# EAGLE design FYDP-Schematic (EAGLE 8.5.2)

## Sheet 1 of 2
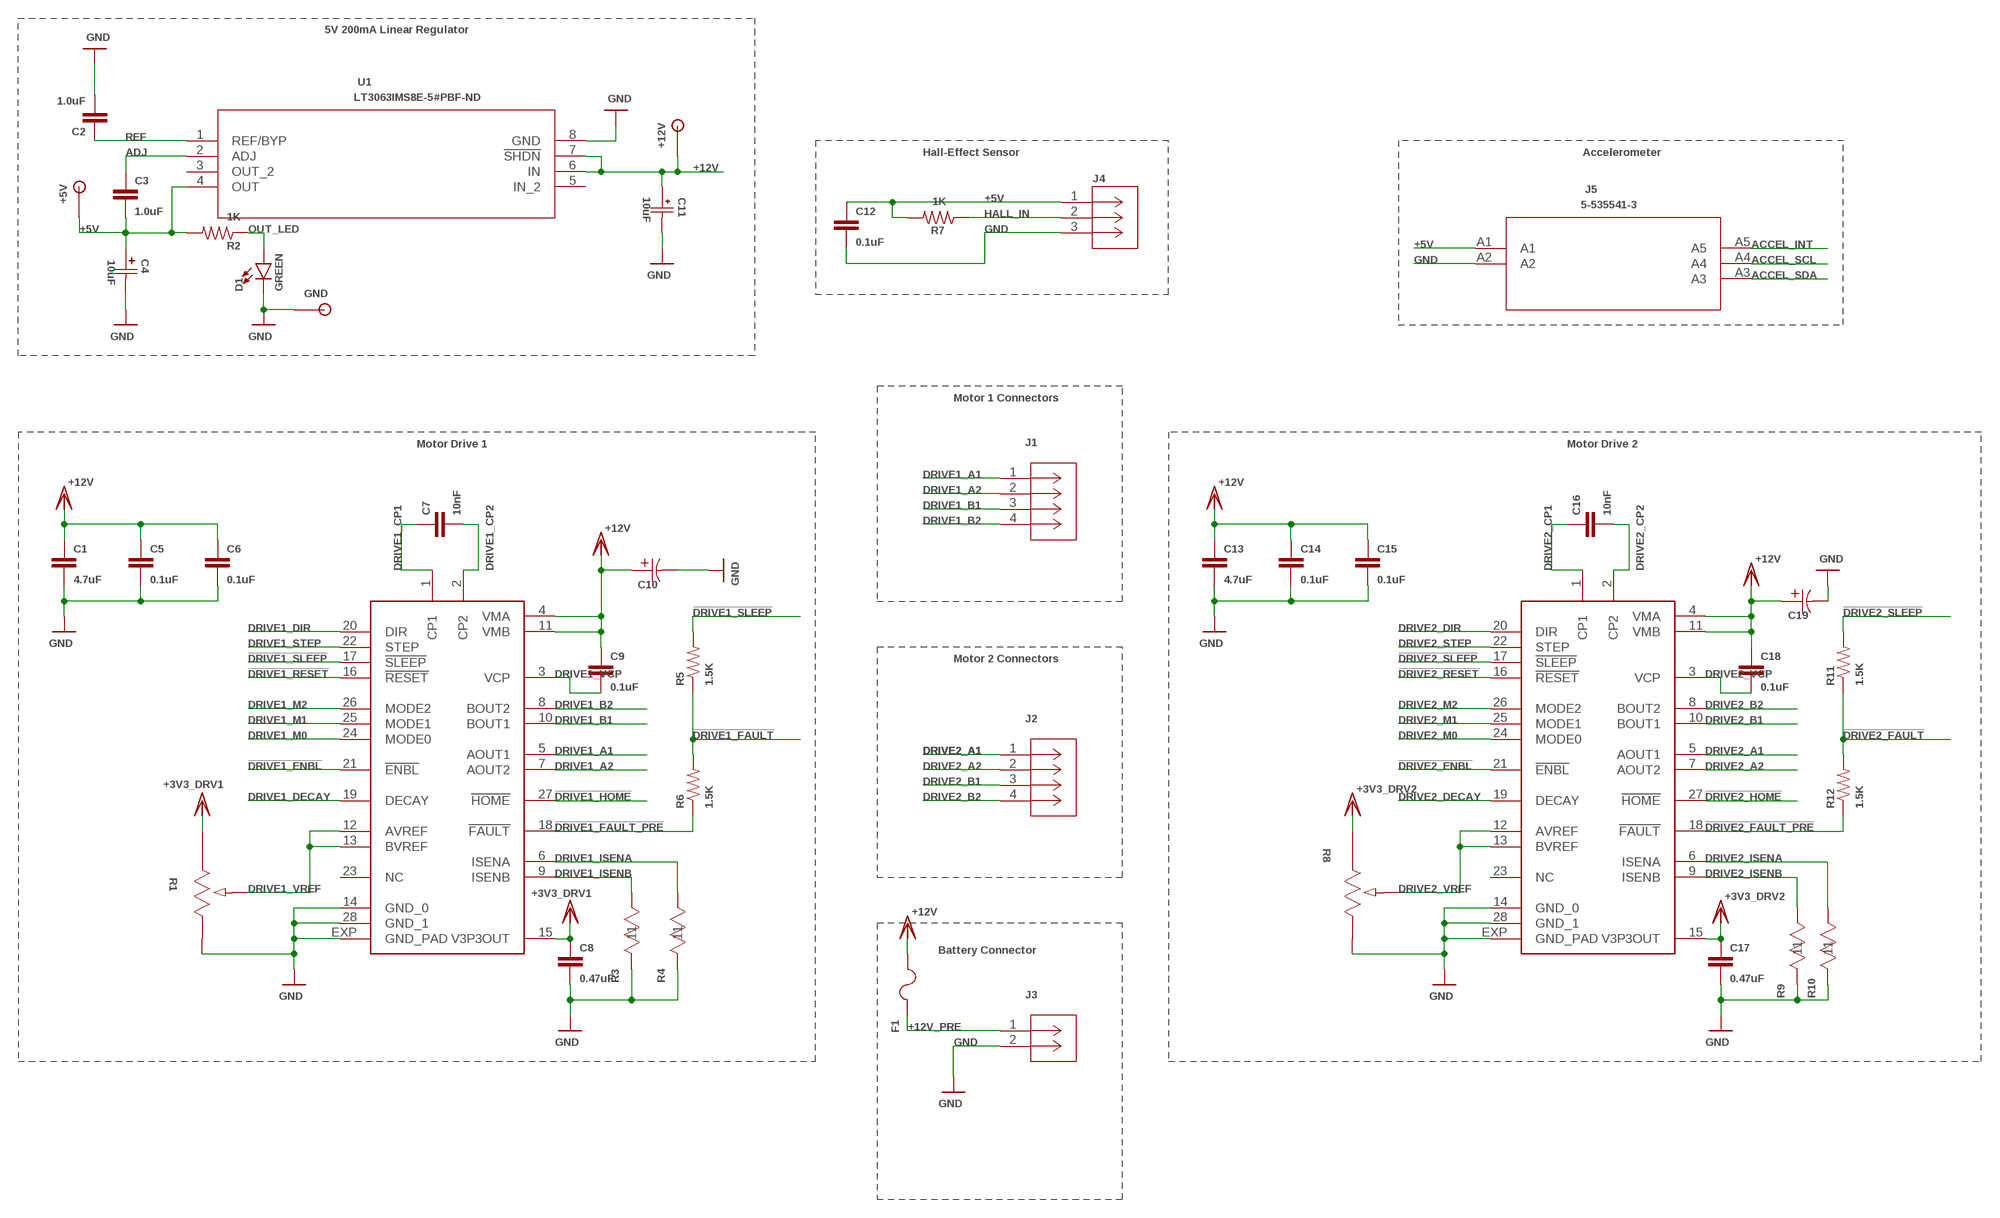
[diagram p0: schematic, sheet 1]

### Parts
+5V  TESTPOINT  [TESTPOINT]
+12V  TESTPOINT  [TESTPOINT]
C1  4.7uF  C_0603  [0603]
C2  1.0uF  1.0UF-0603-16V-10%  [0603]
C3  1.0uF  1.0UF-0603-16V-10%  [0603]
C4  10uF  F931C106MBA  [F93-C]
C5  0.1uF  C_0603  [0603]
C6  0.1uF  C_0603  [0603]
C7  10nF  C_0603  [0603]
C8  0.47uF  C_0603  [0603]
C9  0.1uF  C_0603  [0603]
C10  UWX1C101MCL1GB  [PCAP_6.3X5.4-ELECT]
C11  10uF  GRM188C81C106MA73D  [G-188]
C12  0.1uF  C_0603  [0603]
C13  4.7uF  C_0603  [0603]
C14  0.1uF  C_0603  [0603]
C15  0.1uF  C_0603  [0603]
C16  10nF  C_0603  [0603]
C17  0.47uF  C_0603  [0603]
C18  0.1uF  C_0603  [0603]
C19  UWX1C101MCL1GB  [PCAP_6.3X5.4-ELECT]
D1  GREEN  LED-GREEN0603  [LED-0603]
F1  1210L110/12WR  [1210LSERIES]
GND  TESTPOINT  [TESTPOINT]
J1  2029030-4  [CONN_2029030-4]
J2  2029030-4  [CONN_2029030-4]
J3  2029030-2  [CONN_2029030-2]
J4  2029030-3  [CONN_2029030-3]
J5  5-535541-3  [5-535541-3]
R1  3314G-1-103E  [POT_3314G]
R2  1K  R_0603  [0603]
R3  CSR1206FKR200  [STA_CSR1206]
R4  CSR1206FKR200  [STA_CSR1206]
R5  1.5K  R_0603  [0603]
R6  1.5K  R_0603  [0603]
R7  1K  R_0603  [0603]
R8  3314G-1-103E  [POT_3314G]
R9  CSR1206FKR200  [STA_CSR1206]
R10  CSR1206FKR200  [STA_CSR1206]
R11  1.5K  R_0603  [0603]
R12  1.5K  R_0603  [0603]
U1  LT3063IMS8E-5#PBF-ND  LT3063IMS8EPBF  [MSOP-8_MS]
U2  DRV8825PWP  [TSSOP-28]
U3  DRV8825PWP  [TSSOP-28]

### Nets
!DRIVE1_ENBL!: U3.21(!ENBL!) ; also sheet 2
!DRIVE1_FAULT!: R5.1 R6.2 ; also sheet 2
!DRIVE1_FAULT_PRE!: R6.1 U3.18(!FAULT!)
!DRIVE1_HOME!: U3.27(!HOME!) ; also sheet 2
!DRIVE1_RESET!: U3.16(!RESET!) ; also sheet 2
!DRIVE1_SLEEP!: R5.2 U3.17(!SLEEP!) ; also sheet 2
!DRIVE2_ENBL!: U2.21(!ENBL!) ; also sheet 2
!DRIVE2_FAULT!: R11.1 R12.2 ; also sheet 2
!DRIVE2_FAULT_PRE!: R12.1 U2.18(!FAULT!)
!DRIVE2_HOME!: U2.27(!HOME!) ; also sheet 2
!DRIVE2_RESET!: U2.16(!RESET!) ; also sheet 2
!DRIVE2_SLEEP!: R11.2 U2.17(!SLEEP!) ; also sheet 2
+3V3_DRV1: C8.1 R1.1 U3.15(V3P3OUT)
+3V3_DRV2: C17.1 R8.1 U2.15(V3P3OUT)
+5V: +5V.TP C3.2 C4.POS C12.1 J4.1 J5.A1 R2.2 R7.2 U1.4(OUT) ; also sheet 2
+12V [+12V]: +12V.TP C1.1 C5.1 C6.1 C9.1 C10.1 C11.PWR C13.1 C14.1 C15.1 C18.1 C19.1 F1.2 U1.6(IN) U1.7(!SHDN) U2.4(VMA) U2.11(VMB) U3.4(VMA) U3.11(VMB)
+12V_PRE [+12V]: F1.1 J3.1
ACCEL_INT: J5.A5 ; also sheet 2
ACCEL_SCL: J5.A4 ; also sheet 2
ACCEL_SDA: J5.A3 ; also sheet 2
ADJ: C3.1 U1.2(ADJ)
DRIVE1_A1: J1.1 U3.5(AOUT1)
DRIVE1_A2: J1.2 U3.7(AOUT2)
DRIVE1_B1: J1.3 U3.10(BOUT1)
DRIVE1_B2: J1.4 U3.8(BOUT2)
DRIVE1_CP1: C7.1 U3.1(CP1)
DRIVE1_CP2: C7.2 U3.2(CP2)
DRIVE1_DECAY: U3.19(DECAY) ; also sheet 2
DRIVE1_DIR: U3.20(DIR) ; also sheet 2
DRIVE1_ISENA: R4.2 U3.6(ISENA)
DRIVE1_ISENB: R3.2 U3.9(ISENB)
DRIVE1_M0: U3.24(MODE0) ; also sheet 2
DRIVE1_M1: U3.25(MODE1) ; also sheet 2
DRIVE1_M2: U3.26(MODE2) ; also sheet 2
DRIVE1_STEP: U3.22(STEP) ; also sheet 2
DRIVE1_VCP: C9.2 U3.3(VCP)
DRIVE1_VREF: R1.2 U3.12(AVREF) U3.13(BVREF)
DRIVE2_A1 [DRIVE2]: J2.1 U2.5(AOUT1)
DRIVE2_A2 [DRIVE2]: J2.2 U2.7(AOUT2)
DRIVE2_B1 [DRIVE2]: J2.3 U2.10(BOUT1)
DRIVE2_B2 [DRIVE2]: J2.4 U2.8(BOUT2)
DRIVE2_CP1: C16.1 U2.1(CP1)
DRIVE2_CP2: C16.2 U2.2(CP2)
DRIVE2_DECAY: U2.19(DECAY) ; also sheet 2
DRIVE2_DIR: U2.20(DIR) ; also sheet 2
DRIVE2_ISENA: R10.2 U2.6(ISENA)
DRIVE2_ISENB: R9.2 U2.9(ISENB)
DRIVE2_M0: U2.24(MODE0) ; also sheet 2
DRIVE2_M1: U2.25(MODE1) ; also sheet 2
DRIVE2_M2: U2.26(MODE2) ; also sheet 2
DRIVE2_STEP: U2.22(STEP) ; also sheet 2
DRIVE2_VCP: C18.2 U2.3(VCP)
DRIVE2_VREF: R8.2 U2.12(AVREF) U2.13(BVREF)
GND: C1.2 C2.2 C4.GND C5.2 C6.2 C8.2 C10.2 C11.GND C12.2 C13.2 C14.2 C15.2 C17.2 C19.2 D1.C GND.TP J3.2 J4.3 J5.A2 R1.3 R3.1 R4.1 R8.3 R9.1 R10.1 U1.8(GND) U2.14(GND_0) U2.28(GND_1) U2.EXP(GND_PAD) U3.14(GND_0) U3.28(GND_1) U3.EXP(GND_PAD) ; also sheet 2
HALL_IN: J4.2 R7.1 ; also sheet 2
OUT_LED: D1.A R2.1
REF: C2.1 U1.1(REF/BYP)
Unconnected: U1.3(OUT_2) U1.5(IN_2) U2.23(NC) U3.23(NC)

### Notes on the sheet
- 5V 200mA Linear Regulator
- Hall-Effect Sensor | Accelerometer
- Motor 1 Connectors
- Motor Drive 1 | Motor Drive 2
- Motor 2 Connectors
- Battery Connector

## Sheet 2 of 2
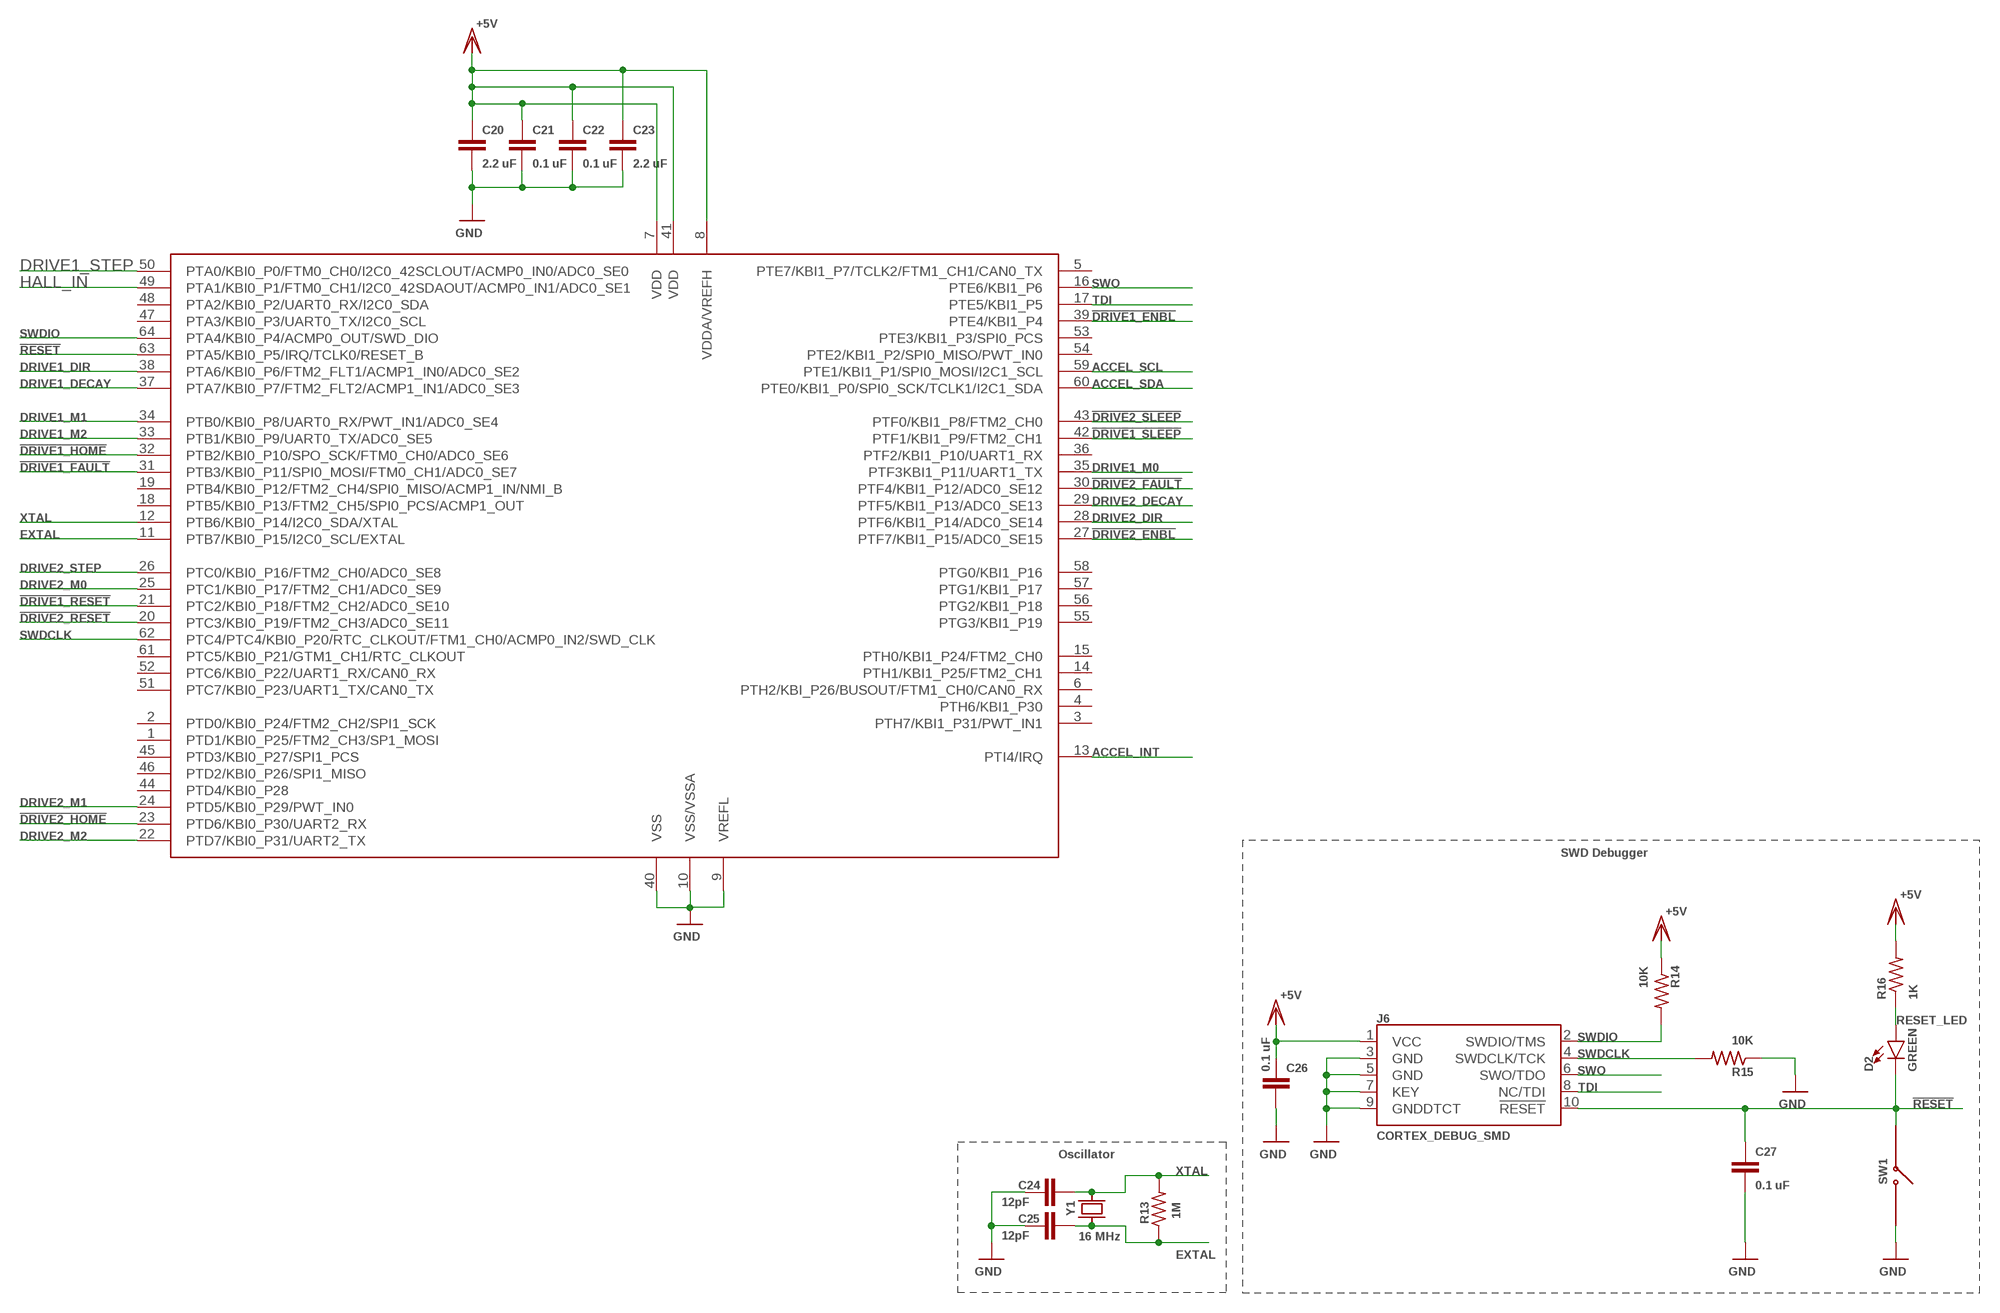
[diagram p1: schematic, sheet 2]

### Parts
C20  2.2 uF  C_0603  [0603]
C21  0.1 uF  C_0603  [0603]
C22  0.1 uF  C_0603  [0603]
C23  2.2 uF  C_0603  [0603]
C24  12pF  C_0603  [0603]
C25  12pF  C_0603  [0603]
C26  0.1 uF  C_0603  [0603]
C27  0.1 uF  C_0603  [0603]
D2  GREEN  LED-GREEN0603  [LED-0603]
J6  CORTEX_DEBUG_SMD  [SAMTECH_FTSH-105-01]
R13  1M  R_0603  [0603]
R14  10K  R_0603  [0603]
R15  10K  R_0603  [0603]
R16  1K  R_0603  [0603]
SW1  KSR223GNCLFG  [KSR223GNCLFG]
U4  S9KEA128  [S9KEA128]
Y1  16 MHz  AT-16.000MAGE-T  [AT-16.000MAGE-T]

### Nets
!DRIVE1_ENBL!: U4.39(PTE4/KBI1_P4) ; also sheet 1
!DRIVE1_FAULT!: U4.31(PTB3/KBI0_P11/SPI0_MOSI/FTM0_CH1/ADC0_SE7) ; also sheet 1
!DRIVE1_HOME!: U4.32(PTB2/KBI0_P10/SPO_SCK/FTM0_CH0/ADC0_SE6) ; also sheet 1
!DRIVE1_RESET!: U4.21(PTC2/KBI0_P18/FTM2_CH2/ADC0_SE10) ; also sheet 1
!DRIVE1_SLEEP!: U4.42(PTF1/KBI1_P9/FTM2_CH1) ; also sheet 1
!DRIVE2_ENBL!: U4.27(PTF7/KBI1_P15/ADC0_SE15) ; also sheet 1
!DRIVE2_FAULT!: U4.30(PTF4/KBI1_P12/ADC0_SE12) ; also sheet 1
!DRIVE2_HOME!: U4.23(PTD6/KBI0_P30/UART2_RX) ; also sheet 1
!DRIVE2_RESET!: U4.20(PTC3/KBI0_P19/FTM2_CH3/ADC0_SE11) ; also sheet 1
!DRIVE2_SLEEP!: U4.43(PTF0/KBI1_P8/FTM2_CH0) ; also sheet 1
!RESET!: C27.1 D2.C J6.10(!RESET) SW1.1 U4.63(PTA5/KBI0_P5/IRQ/TCLK0/RESET_B)
+5V: C20.1 C21.1 C22.1 C23.1 C26.1 J6.1(VCC) R14.1 R16.2 U4.7(VDD) U4.8(VDDA/VREFH) U4.41(VDD) ; also sheet 1
ACCEL_INT: U4.13(PTI4/IRQ) ; also sheet 1
ACCEL_SCL: U4.59(PTE1/KBI1_P1/SPI0_MOSI/I2C1_SCL) ; also sheet 1
ACCEL_SDA: U4.60(PTE0/KBI1_P0/SPI0_SCK/TCLK1/I2C1_SDA) ; also sheet 1
DRIVE1_DECAY: U4.37(PTA7/KBI0_P7/FTM2_FLT2/ACMP1_IN1/ADC0_SE3) ; also sheet 1
DRIVE1_DIR: U4.38(PTA6/KBI0_P6/FTM2_FLT1/ACMP1_IN0/ADC0_SE2) ; also sheet 1
DRIVE1_M0: U4.35(PTF3KBI1_P11/UART1_TX) ; also sheet 1
DRIVE1_M1: U4.34(PTB0/KBI0_P8/UART0_RX/PWT_IN1/ADC0_SE4) ; also sheet 1
DRIVE1_M2: U4.33(PTB1/KBI0_P9/UART0_TX/ADC0_SE5) ; also sheet 1
DRIVE1_STEP: U4.50(PTA0/KBI0_P0/FTM0_CH0/I2C0_42SCLOUT/ACMP0_IN0/ADC0_SE0) ; also sheet 1
DRIVE2_DECAY: U4.29(PTF5/KBI1_P13/ADC0_SE13) ; also sheet 1
DRIVE2_DIR: U4.28(PTF6/KBI1_P14/ADC0_SE14) ; also sheet 1
DRIVE2_M0: U4.25(PTC1/KBI0_P17/FTM2_CH1/ADC0_SE9) ; also sheet 1
DRIVE2_M1: U4.24(PTD5/KBI0_P29/PWT_IN0) ; also sheet 1
DRIVE2_M2: U4.22(PTD7/KBI0_P31/UART2_TX) ; also sheet 1
DRIVE2_STEP: U4.26(PTC0/KBI0_P16/FTM2_CH0/ADC0_SE8) ; also sheet 1
EXTAL: C25.1 R13.1 U4.11(PTB7/KBI0_P15/I2C0_SCL/EXTAL) Y1.1
GND: C20.2 C21.2 C22.2 C23.2 C24.2 C25.2 C26.2 C27.2 J6.3(GND) J6.5(GND) J6.7(KEY) J6.9(GNDDTCT) R15.1 SW1.2 U4.9(VREFL) U4.10(VSS/VSSA) U4.40(VSS) ; also sheet 1
HALL_IN: U4.49(PTA1/KBI0_P1/FTM0_CH1/I2C0_42SDAOUT/ACMP0_IN1/ADC0_SE1) ; also sheet 1
RESET_LED: D2.A R16.1
SWDCLK: J6.4(SWDCLK/TCK) R15.2 U4.62(PTC4/PTC4/KBI0_P20/RTC_CLKOUT/FTM1_CH0/ACMP0_IN2/SWD_CLK)
SWDIO: J6.2(SWDIO/TMS) R14.2 U4.64(PTA4/KBI0_P4/ACMP0_OUT/SWD_DIO)
SWO: J6.6(SWO/TDO) U4.16(PTE6/KBI1_P6)
TDI: J6.8(NC/TDI) U4.17(PTE5/KBI1_P5)
XTAL: C24.1 R13.2 U4.12(PTB6/KBI0_P14/I2C0_SDA/XTAL) Y1.2
Unconnected: U4.1(PTD1/KBI0_P25/FTM2_CH3/SP1_MOSI) U4.2(PTD0/KBI0_P24/FTM2_CH2/SPI1_SCK) U4.3(PTH7/KBI1_P31/PWT_IN1) U4.4(PTH6/KBI1_P30) U4.5(PTE7/KBI1_P7/TCLK2/FTM1_CH1/CAN0_TX) U4.6(PTH2/KBI_P26/BUSOUT/FTM1_CH0/CAN0_RX) U4.14(PTH1/KBI1_P25/FTM2_CH1) U4.15(PTH0/KBI1_P24/FTM2_CH0) U4.18(PTB5/KBI0_P13/FTM2_CH5/SPI0_PCS/ACMP1_OUT) U4.19(PTB4/KBI0_P12/FTM2_CH4/SPI0_MISO/ACMP1_IN/NMI_B) U4.36(PTF2/KBI1_P10/UART1_RX) U4.44(PTD4/KBI0_P28) U4.45(PTD3/KBI0_P27/SPI1_PCS) U4.46(PTD2/KBI0_P26/SPI1_MISO) U4.47(PTA3/KBI0_P3/UART0_TX/I2C0_SCL) U4.48(PTA2/KBI0_P2/UART0_RX/I2C0_SDA) U4.51(PTC7/KBI0_P23/UART1_TX/CAN0_TX) U4.52(PTC6/KBI0_P22/UART1_RX/CAN0_RX) U4.53(PTE3/KBI1_P3/SPI0_PCS) U4.54(PTE2/KBI1_P2/SPI0_MISO/PWT_IN0) U4.55(PTG3/KBI1_P19) U4.56(PTG2/KBI1_P18) U4.57(PTG1/KBI1_P17) U4.58(PTG0/KBI1_P16) U4.61(PTC5/KBI0_P21/GTM1_CH1/RTC_CLKOUT)

### Notes on the sheet
- SWD Debugger
- Oscillator

## Library data of the parts
+5V +12V GND = FYDP:TESTPOINT
C1 C5-C9 C12-C18 C20-C27 = RHD2000_eval_board:C: Capacitor
C2 C3 = SparkFun-Capacitors:1.0UF: 1µF ceramic capacitors A capacitor is a passive two-terminal electrical component used to store electrical energy temporarily in an electric field.; PROD_ID: CAP-00868
C4 = capacitors:F931C106MBA; MANUFACTURER_PART_NUMBER: F931C106MBA; VENDOR: AVX Corporation
C10 C19 = FYDP:UWX1C101MCL1GB; MANUFACTURER_PART_NUMBER: UWX1C101MCL1GB; VENDOR: Nichicon
C11 = ceramic-capacitors:GRM188C81C106MA73D; MANUFACTURER_PART_NUMBER: GRM188C81C106MA73D; VENDOR: Murata
D1 D2 = SparkFun-LED:LED-GREEN: Green SMD LED Used in manufacturing of various products at SparkFun Packages: 0603 - SMD 0603 package [Product Link] <http://www.futureelectronics.com/en/technologies/semiconductors/optoelectronics/leds/Pages/9894312-LTST-C190GKT.aspx?CrossPart=HSMG-C190&IM=0> LilyPad 1206 - SMD1206 LilyPad package [Product Link] <http://www.futureelectronics.com/en/Technologies/Product.aspx?ProductID=IN150NGHARVATEKCORPORATION2049943&IM=0> 1206 - SMD1206 package [Product Link] <http://www.futureelectronics.com/en/technologies/semiconductors/optoelectronics/leds/Pages/8315665-LTST-C150KGKT.aspx?IM=0> 1206 Bottom Mount -SMD 1206 Bottom Mount [Product Link] <http://www.digikey.com/product-detail/en/lite-on-inc/LTST-C230KGKT/160-1456-1-ND/386854> SparkFun Products: Pro Mini 328 -5V <https://www.sparkfun.com/products/821> RedBoard <https://www.sparkfun.com/products/12757> MP3 Trigger <https://www.sparkfun.com/products/13720> Makey Makey <https://www.sparkfun.com/products/11076>; PROD_ID: DIO-00821
F1 = FYDP:1210L110/12WR; MANUFACTURER_PART_NUMBER: 1210L11012WR; VENDOR: Littelfuse Inc
J1 J2 = FYDP:2029030-4; MANUFACTURER_PART_NUMBER: 20290304; VENDOR: Tyco Electronics
J3 = FYDP:2029030-2; MANUFACTURER_PART_NUMBER: 20290302; VENDOR: Tyco Electronics
J4 = FYDP:2029030-3; MANUFACTURER_PART_NUMBER: 20290303; VENDOR: TE Connectivity
J5 = FYDP:5-535541-3; MANUFACTURER_PART_NUMBER: 55355413; VENDOR: TE Connectivity
J6 = SparkFun-Connectors:CORTEX_DEBUG: Cortex Debug Connector - 10 pin Supports JTAG debug, Serial Wire debug, and Serial Wire Viewer. PTH and SMD connector options available. General Connector Information <http://infocenter.arm.com/help/topic/com.arm.doc.faqs/attached/13634/cortex_debug_connectors.pdf> Products: PTH Connector <http://www.digikey.com/product-detail/en/cnc-tech/3220-10-0100-00/1175-1627-ND/3883661> -via Digi-Key SparkFun PSoc <https://www.sparkfun.com/products/13229> SparkFun T <https://www.sparkfun.com/products/13810>
R1 R8 = FYDP:3314G-1-103E; MANUFACTURER_PART_NUMBER: 3314G1103E; VENDOR: Bourns Electronics
R2 R5-R7 R11-R16 = RHD2000_eval_board:R: Resistor
R3 R4 R9 R10 = FYDP:CSR1206FKR200; MANUFACTURER_PART_NUMBER: CSR1206FKR200; VENDOR: Stackpole International
SW1 = FYDP:KSR223GNCLFG
U1 = FYDP:LT3063IMS8EPBF; MANUFACTURER_PART_NUMBER: lt3063ims8e#pbf; VENDOR: Linear Technology
U2 U3 = drv8825:DRV8825PWP
U4 = FYDP:S9KEA128
Y1 = FYDP:AT-16.000MAGE-T

## Net classes
0 default: width 0.152 mm, clearance 0.152 mm
1 +12V: width 0.254 mm, clearance 0.254 mm
2 +5V: width 0.381 mm, clearance 0.254 mm
3 DRIVE2: width 0.508 mm, clearance 0.254 mm

## Board
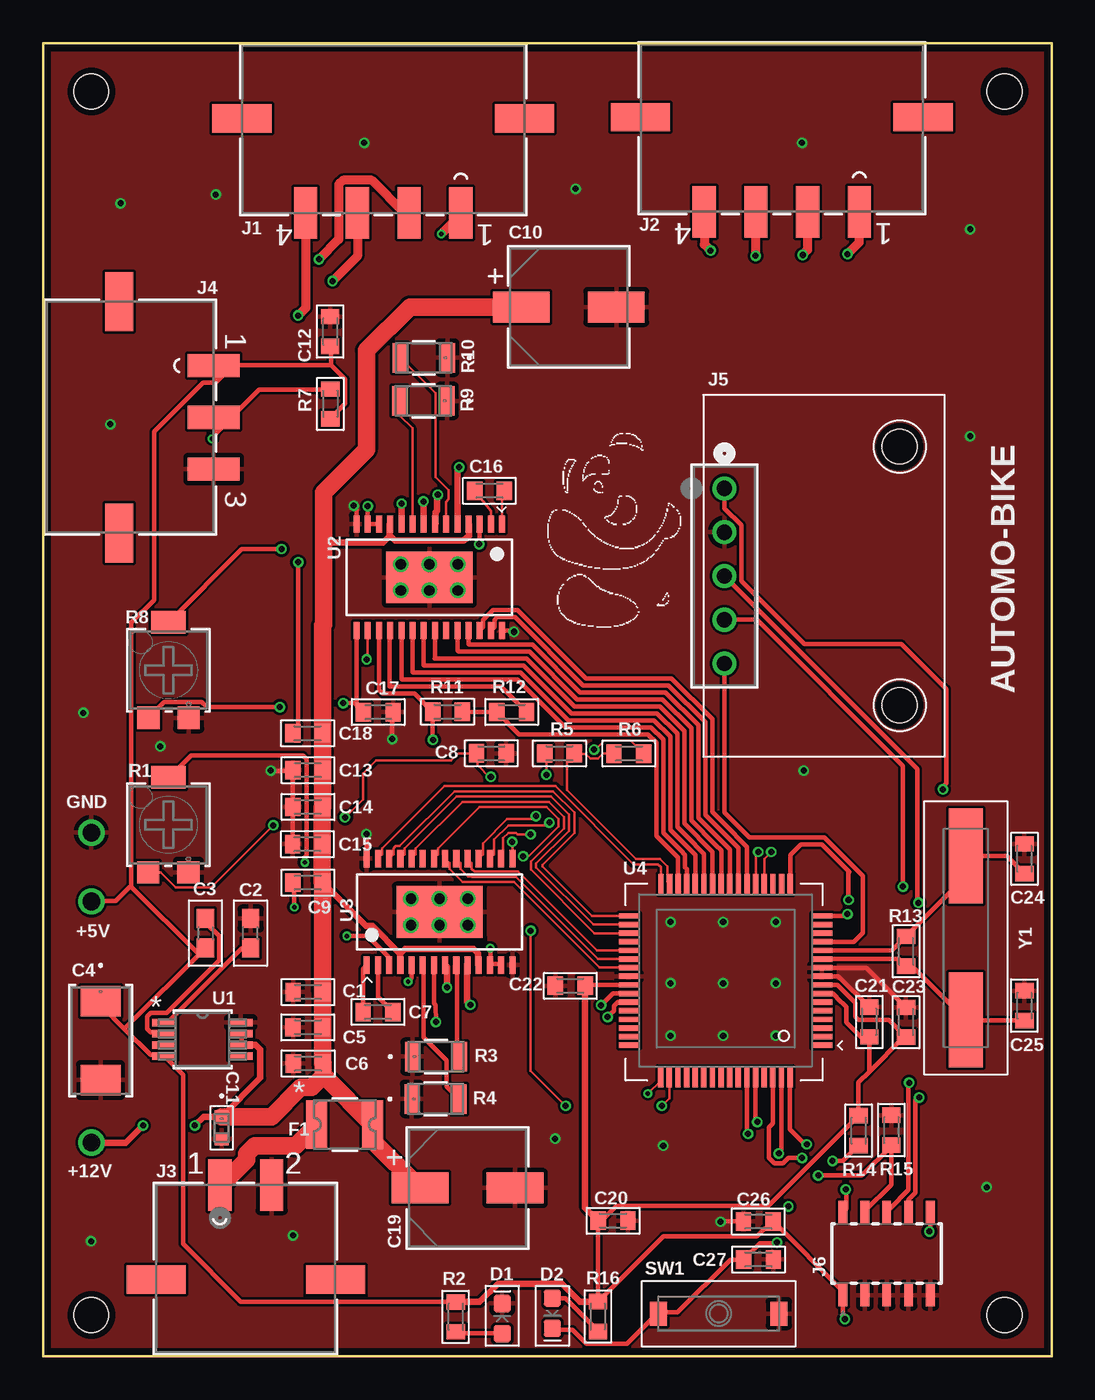
[diagram p2: board, top side]
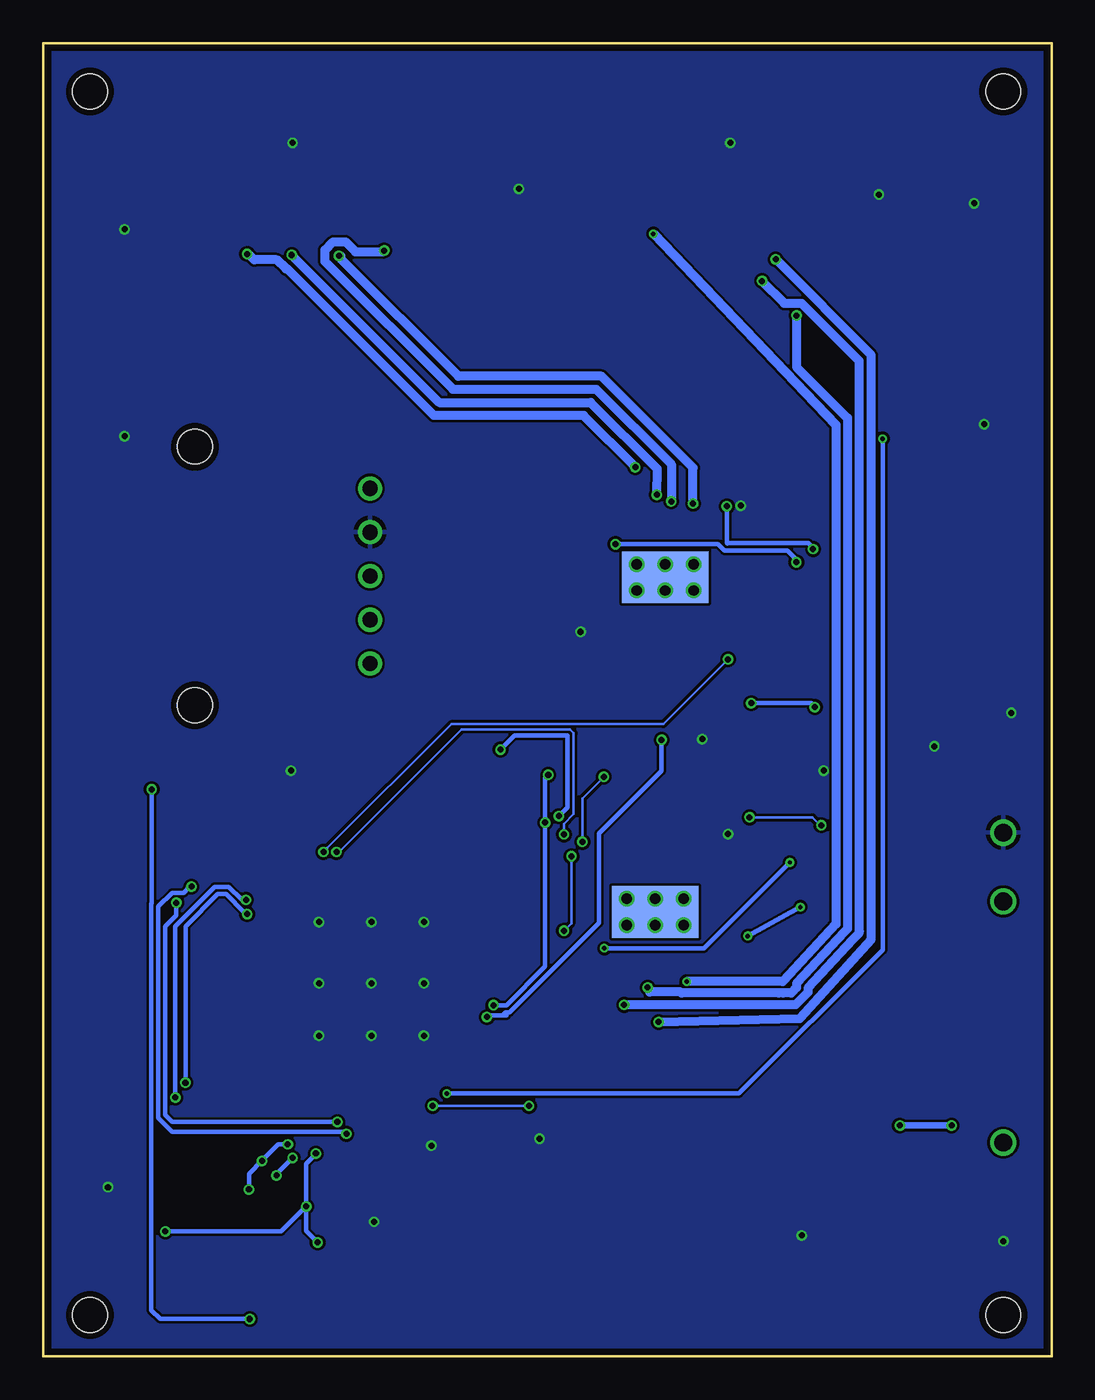
[diagram p3: board, bottom side, seen from below]

Size 58.52 x 76.21 mm. Coordinates in mm from the lower left corner, seen from the top.
Outline: 0,0 0,76.2 58.52,76.21 58.52,0.01 0,0
Copper layers (1*16): Top 0.035559375mm / dielectric 1.6mm / Bottom 0.035559375mm
Design rules "oshparkdrc": minimum track width 6mil, minimum drill 10mil, track to track 6mil, track to pad 6mil, pad to pad 6mil, via to via 6mil, smd to smd 6mil, copper to edge 15mil, drill to drill 6mil, minimum pad ring 5mil, minimum via ring 5mil, stop-mask expansion 2.5mil, vias tented up to drill 0mil, thermal gap 10mil
Holes 2 mm at 2.8,2.4 55.8,2.4 55.8,73.4 2.8,73.4

### Footprints (pad centres in the part's own frame; a part is rotated, then mirrored left to right if it is on the bottom)
TESTPOINT = drill 1.02: TP 0,0
0603 = smd 0.889 x 1.067: 1 -0.864,0; 2 0.864,0
0603' = smd 1.1 x 1: 1 -0.85,0; 2 0.85,0
F93-C = smd 1.778 x 2.311: GND 2.286,0; POS -2.286,0
PCAP_6.3X5.4-ELECT = smd 3.302 x 1.803: 1 -2.756,0; 2 2.756,0
G-188 = smd 0.711 x 0.813: GND 0.648,0; PWR -0.648,0
LED-0603 = smd 1 x 1: A -0.877,0; C 0.877,0
1210LSERIES = smd 1.219 x 2.794: 1 -1.626,0; 2 1.626,0
CONN_2029030-4 = smd 1.346 x 2.997: 1 -4.555,5.334; 2 -1.555,5.334; 3 1.445,5.334; 4 4.445,5.334 | smd 3.429 x 1.651: 9 -8.259,-0.152; 10 8.149,-0.152
CONN_2029030-2 = smd 1.346 x 2.997: 1 -1.603,5.461; 2 1.397,5.461 | smd 3.429 x 1.651: 7 -5.31,-0.025; 8 5.104,-0.025
CONN_2029030-3 = smd 1.346 x 2.997: 1 -6,0; 2 -3,0; 3 0,0 | smd 3.429 x 1.651: 8 -9.706,-5.486; 9 3.706,-5.486
5-535541-3 = drill 0.889 pad 1.397: A1 -5.08,-5.769; A2 -2.54,-5.769; A3 0,-5.769; A4 2.54,-5.769; A5 5.08,-5.769 | hole 2: -7.5,4.4; 7.5,4.4
SAMTECH_FTSH-105-01 = smd 0.508 x 1.27: 1 -2.54,-2.413; 2 -2.54,2.413; 3 -1.27,-2.413; 4 -1.27,2.413; 5 0,-2.413; 6 0,2.413; 7 1.27,-2.413; 8 1.27,2.413; 9 2.54,-2.413; 10 2.54,2.413
POT_3314G = smd 1.295 x 1.295: 1 -1.168,-2.769; 3 1.168,-2.769 | smd 2.007 x 1.295: 2 0,2.769
STA_CSR1206 = smd 0.864 x 1.702: 1 -1.372,0; 2 1.372,0
KSR223GNCLFG = smd 1 x 1.4: 1 -3.5,0; 2 3.5,0
MSOP-8_MS = smd 1.397 x 0.432: 1 -2.21,0.975; 2 -2.21,0.325; 3 -2.21,-0.325; 4 -2.21,-0.975; 5 2.21,-0.975; 6 2.21,-0.325; 7 2.21,0.325; 8 2.21,0.975
TSSOP-28 = smd 0.35 x 1: 1 -4.225,-3.087; 2 -3.575,-3.087; 3 -2.925,-3.087; 4 -2.275,-3.087; 5 -1.625,-3.087; 6 -0.975,-3.087; 7 -0.325,-3.087; 8 0.325,-3.087; 9 0.975,-3.087; 10 1.625,-3.087; 11 2.275,-3.087; 12 2.925,-3.087; 13 3.575,-3.087; 14 4.225,-3.087; 15 4.225,3.087; 16 3.575,3.087; 17 2.925,3.087; 18 2.275,3.087; 19 1.625,3.087; 20 0.975,3.087; 21 0.325,3.087; 22 -0.325,3.087; 23 -0.975,3.087; 24 -1.625,3.087; 25 -2.275,3.087; 26 -2.925,3.087; 27 -3.575,3.087; 28 -4.225,3.087 | smd 5 x 3: EXP 0,0 | smd 5 x 3 bottom: EXP1 0,0 | drill 0.6: P$1 -1.651,0.762; P$2 0,0.762; P$3 1.651,0.762; P$4 1.651,-0.762; P$5 0,-0.762; P$6 -1.651,-0.762
S9KEA128 = smd 1.188 x 0.312: 1 -5.682,3.671; 2 -5.682,3.171; 3 -5.682,2.671; 4 -5.682,2.171; 5 -5.682,1.671; 6 -5.682,1.171; 7 -5.682,0.671; 8 -5.682,0.171; 9 -5.682,-0.329; 10 -5.682,-0.829; 11 -5.682,-1.329; 12 -5.682,-1.829; 13 -5.682,-2.329; 14 -5.682,-2.829; 15 -5.682,-3.329; 16 -5.682,-3.829; 33 5.512,-3.829; 34 5.512,-3.329; 35 5.512,-2.829; 36 5.512,-2.329; 37 5.512,-1.829; 38 5.512,-1.329; 39 5.512,-0.829; 40 5.512,-0.329; 41 5.512,0.171; 42 5.512,0.671; 43 5.512,1.171; 44 5.512,1.671; 45 5.512,2.171; 46 5.512,2.671; 47 5.512,3.171; 48 5.512,3.671 | smd 0.312 x 1.188: 17 -3.838,-5.685; 18 -3.338,-5.685; 19 -2.838,-5.685; 20 -2.338,-5.685; 21 -1.838,-5.685; 22 -1.338,-5.685; 23 -0.838,-5.685; 24 -0.338,-5.685; 25 0.162,-5.685; 26 0.662,-5.685; 27 1.162,-5.685; 28 1.662,-5.685; 29 2.162,-5.685; 30 2.662,-5.685; 31 3.162,-5.685; 32 3.662,-5.685; 49 3.671,5.516; 50 3.171,5.516; 51 2.671,5.516; 52 2.171,5.516; 53 1.671,5.516; 54 1.171,5.516; 55 0.67,5.516; 56 0.171,5.516; 57 -0.33,5.516; 58 -0.83,5.516; 59 -1.329,5.516; 60 -1.829,5.516; 61 -2.329,5.516; 62 -2.829,5.516; 63 -3.329,5.516; 64 -3.829,5.516
AT-16.000MAGE-T = smd 5.5 x 2: 1 -4.75,0; 2 4.75,0

### Placement (x,y rotation side)
+5V  2.8,26.4 0 top
+12V  2.8,12.4 0 top
C1  15.37,21.14 180 top
C2  1.0uF  [0603']  12.04,24.56 90 top
C3  1.0uF  [0603']  9.42,24.56 270 top
C4  3.34,18.32 270 top
C5  15.36,19.09 180 top
C6  15.38,17 180 top
C7  19.43,19.99 0 top
C8  26.02,35 0 top
C9  15.37,27.5 180 top
C10  30.51,60.9 0 top
C11  10.37,13.26 270 top
C12  16.66,59.47 90 top
C13  15.37,34.02 180 top
C14  15.37,31.89 180 top
C15  15.34,29.73 180 top
C16  25.91,50.23 180 top
C17  19.45,37.39 0 top
C18  15.35,36.16 180 top
C19  24.63,9.78 0 top
C20  33.08,7.87 0 top
C21  47.95,19.4 90 top
C22  30.6,21.51 180 top
C23  50.08,19.39 90 top
C24  56.96,28.88 90 top
C25  56.95,20.36 90 top
C26  41.51,7.83 180 top
C27  41.52,5.63 0 top
D1  26.65,2.19 90 top
D2  29.56,2.51 270 top
F1  17.51,13.45 0 top
GND  2.8,30.4 0 top
J1  19.68,71.68 180 top
J2  42.81,71.75 180 top
J3  11.87,4.49 0 top
J4  9.9,51.49 270 top
J5  45.31,45.29 270 top
J6  48.96,5.97 0 top
R1  7.27,30.85 0 top
R2  23.94,2.3 90 top
R3  22.8,17.4 0 top
R4  22.77,14.94 0 top
R5  29.97,34.99 180 top
R6  34,34.98 180 top
R7  16.68,55.27 270 top
R8  7.28,39.82 0 top
R9  22.07,55.44 180 top
R10  22.1,57.95 180 top
R11  23.47,37.41 180 top
R12  27.2,37.4 180 top
R13  50.08,23.51 90 top
R14  47.32,13.1 270 top
R15  49.23,13.13 270 top
R16  32.2,2.32 90 top
SW1  39.21,2.48 0 top
U1  9.25,18.4 0 top
U2  22.42,45.21 180 top
U3  23.01,25.79 0 top
U4  39.52,21.73 180 top
Y1  53.55,24.28 90 top

### Tracks (layer width: path | path; a pad name or v marks a point on that pad's centre or on a via)
!DRIVE1_ENBL!
  Top 0.152: U3.21 23.58,28.64 23.58,28.29 24.34,27.52 27.32,27.52 32.28,22.56 U4.39
!DRIVE1_FAULT!
  Top 0.152: U4.31 36.24,27.53 36.24,28.44 35.81,28.87 34.4,28.87 30.4,32.86 30.4,34.56 30.81,34.96 | R5.1 30.81,34.96 | R6.2 32.49,34.98 32.2,34.69 31.76,34.69 31.48,34.96 30.81,34.96
!DRIVE1_FAULT_PRE!  (via drill 0.35)
  Top 0.152: U3.18 25.53,29.13 25.53,29.77 26.93,31.18 28.52,31.18 28.52,31.28 v28.6,31.35 | v31.98,35.22 32.06,35.22 32.59,35.74 34.1,35.74 R6.1
  Bottom 0.152: 31.95,35.19 v31.98,35.22
  Bottom 0.254: v28.6,31.35 28.09,31.86 28.09,36.03 31.16,36.03 v31.98,35.22
!DRIVE1_HOME!
  Top 0.152: U3.27 19.68,29.13 19.68,29.48 23.3,33.1 29.73,33.1 34.27,28.56 35.68,28.56 35.85,28.39 U4.32
!DRIVE1_RESET!  (via drill 0.35)
  Top 0.152: v28.29,30.29 27.54,30.29 27.45,30.39 27.01,30.39 26.7,30.08 26.7,29 U3.16 | v41.5,29.27 41.35,29.13 U4.21
  Bottom 0.152: v28.29,30.29 28.29,30.91 27.73,31.46 27.73,36.18 27.94,36.38 34.23,36.38 41.36,29.25 41.48,29.25 v41.5,29.27
!DRIVE1_SLEEP!  (via drill 0.35)
  Top 0.152: U3.17 26.18,29.13 26.18,29.99 27.01,30.82 29.33,30.82 29.33,30.92 v29.38,30.97 | v29.21,33.74 29.21,34.89 R5.2
  Top 0.254: v32.38,20.38 33.06,21.06 U4.42
  Bottom 0.152: 29.23,33.74 v29.21,33.74
  Bottom 0.254: v29.21,33.74 29.38,33.56 v29.38,30.97 29.38,22.62 31.62,20.38 v32.38,20.38 32.38,20.36 32.28,20.25
!DRIVE2_ENBL!
  Top 0.254: U2.21 22.09,40.12 22.12,40.09 27.88,40.09 30.66,37.32 35.62,37.32 36.8,36.14 36.8,30.72 37.36,30.16 | 37.36,30.16 | 37.36,30.16 38.35,29.16 U4.27
!DRIVE2_FAULT!
  Top 0.254: R11.1 24.35,37.39 R12.2 27.63,36.1 35.12,36.1 35.58,35.63 35.58,30.21 36.85,28.94 U4.30
!DRIVE2_FAULT_PRE!
  Top 0.254: R12.1 26.58,38.87 20.11,38.87 20.11,42.09 U2.18
!DRIVE2_HOME!
  Top 0.254: U2.27 26.19,42.32 26.19,42.74 26.35,42.9 27.38,42.9 31.33,38.94 36.29,38.94 38.43,36.81 38.43,31.43 39.36,30.5 | 39.36,30.5 | U4.23 40.35,29.5 39.36,30.5
!DRIVE2_RESET!  (via drill 0.35)
  Top 0.152: U2.16 18.84,40.52 v18.77,40.45 | v42.26,29.27 41.85,28.87 U4.20
  Bottom 0.152: v18.77,40.45 22.53,36.69 34.83,36.69 42.03,29.49 42.03,29.27 v42.26,29.27
!DRIVE2_SLEEP!  (via drill 0.35)
  Top 0.254: U2.17 19.49,38.68 19.71,38.47 21.55,38.47 R11.2 22.61,35.81 22.6,35.8 v22.63,35.77 | U4.43 33.36,20.56 33.13,20.33 33.13,20.06 32.97,19.9 v32.76,19.7
  Bottom 0.254: v32.76,19.7 32.66,19.8 31.85,19.8 | 31.85,19.8 31.63,19.8 | v22.63,35.77 22.63,33.97 26.26,30.34 26.26,25.17 31.45,19.98 31.67,19.98 31.85,19.8
!RESET!  (via drill 0.35)
  Top 0.254: D2.C 29.61,1.53 30.73,1.53 31.54,0.72 33.88,0.72 35.61,2.45 SW1.1 35.81,2.55 36.83,2.55 39.87,5.6 40.59,5.6 C27.1 41.59,6.56 42.47,6.56 42.52,6.61 v42.59,6.61 | 43.33,8.7 v43.25,8.7 | v42.69,11.77 42.85,11.93 U4.63 | J6.10 51.5,7.36 51.51,7.35 51.43,7.28 v51.43,7.25
  Bottom 0.254: v43.25,8.7 43.25,11.16 42.69,11.72 v42.69,11.77 | v51.43,7.25 44.7,7.25 v43.25,8.7 | v42.59,6.61 43.25,7.27 v43.25,8.7
+3V3_DRV1  (via drill 0.35)
  Top 0.152: U3.15 v27.23,29.85 v27.23,29.86 | v17.52,31.28 18.56,32.32 18.56,33.82 19.33,34.58 23.69,34.58 24.1,35 C8.1 25.21,34.31 25.98,33.54 | R1.1 6.82,28.08 7.7,27.2 9.74,27.2 v13.36,30.82 | 26.03,33.49 25.98,33.54 | 25.98,33.54 v25.98,33.63
  Bottom 0.152: v17.52,31.28 13.87,31.28 13.43,30.85 13.38,30.85 v13.36,30.82 | v25.98,33.63 27.23,32.39 v27.23,29.86
+3V3_DRV2  (via drill 0.35)
  Top 0.254: U2.15 18.19,37.78 C17.1 18.07,37.91 v17.42,37.91 | v13.74,37.68 9.52,37.68 9.21,37.98 7.04,37.98 R8.1
  Bottom 0.254: v17.42,37.91 13.94,37.91 13.71,37.68 | 13.69,37.65 13.71,37.68 | 13.71,37.68 v13.74,37.68
+5V  (via drill 0.35)
  Top 0.254: U4.41 33.98,21.55 31.54,21.55 C22.1 | 6.96,17.49 6.25,17.49 4.72,19.01 | 4.72,19.01 3.4,20.33 3.4,20.53 C4.POS | 6.96,17.49 U1.4 | 4.72,19.01 9.39,23.68 C3.2 8.99,23.38 5.13,27.24 | 16.71,57.52 16.71,58.53 C12.1 | 16.71,57.52 17.52,56.7 17.52,55.28 16.71,54.47 R7.2 | 16.71,57.52 11.02,57.52 10,56.5 10,56.51 | 10,56.51 J4.1 | 5.13,27.24 5.13,42.58 6.45,43.9 6.45,53.66 9.29,56.5 9.9,56.5 10,56.51 | +5V.TP 2.89,26.43 4.21,26.43 5.03,27.24 5.13,27.24 | 47.95,16.52 47.95,18.4 | 47.95,18.4 C21.1 | 47.95,16.52 49.96,18.53 C23.1 49.09,19.52 47.33,19.52 47.14,19.71 47.14,20.51 46.08,21.56 U4.8 | U4.7 45.84,21.06 46.07,20.83 46.07,20.81 46.61,20.28 46.61,19.39 47.6,18.4 47.95,18.4 | 47.29,14.03 R14.1 | R14.1 47.33,15.89 47.95,16.52 | R14.1 42.11,8.75 33.27,8.75 32.4,7.87 C20.1 R16.2 35.99,6.97 41.42,6.97 41.88,7.43 41.96,7.43 C26.1 46.41,3.79 J6.1 46.41,2.28 v46.53,2.17 | J5.A1 39.54,49.21 40.52,48.23 40.52,44.98 44.17,41.34 49.81,41.34 52.42,38.72 52.42,33.23 52.22,33.03 v52.22,32.9 | 6.96,17.49 8.12,16.32 8.12,6.52 11.48,3.16 R2.2
  Top 0.381: R2.2 25.34,3.16 26.41,4.23 30.12,4.23 31.17,3.18 R16.2 | C20.1 31.46,8.63 C22.1
  Bottom 0.254: v52.22,32.9 52.22,26.3 52.24,26.27 52.24,2.68 51.74,2.17 v46.53,2.17 46.48,2.17
+12V  (via drill 0.35)
  Top 0.254: U1.7 11.53,18.71 11.53,18.1 U1.6 11.63,18.1
  Top 0.381: C9.1 18.76,24.97 19.12,24.97 20.73,23.36 | 20.73,23.36 U3.4 | U3.11 25.25,22.74 25.25,23.39 24.99,23.65 21.02,23.65 20.73,23.36 | 11.63,18.1 11.64,18.08 12.35,18.08 12.61,17.82 12.61,16.15 C11.PWR 9.31,13.91 v8.8,13.4 | v5.8,13.4 4.8,12.4 +12V.TP | 20.11,47.61 20.11,48.27 U2.11 | 16.29,47.23 19.73,47.23 20.11,47.61 | 20.11,47.61 20.17,47.61 20.43,47.35 24.4,47.35 24.71,47.61 24.71,48.27 U2.4
  Top 0.508: C9.1 16.21,27.52 | 16.21,31.86 C14.1 | C13.1 16.21,34.04
  Top 1.016: 16.21,27.52 C15.1 16.21,31.86 | C14.1 C13.1 | 16.21,34.04 C18.1 16.21,42.4 16.29,42.47 16.29,47.23 16.29,50.13 18.77,52.61 18.77,58.38 21.29,60.9 C10.1 | C19.1 19.14,12.52 F1.2 16.32,16.26 16.25,16.26 | 16.25,16.26 C6.1 16.23,17.02 C5.1 16.24,19.1 C1.1 C9.1 | 16.25,16.26 15.59,15.61 14.96,15.61 13.26,13.91 C11.PWR
  Bottom 0.381: v8.8,13.4 v5.8,13.4
+12V_PRE
  Top 0.254: F1.1 15.9,13.42 15.9,12.61 15.8,12.4
  Top 0.508: 10.37,9.95 J3.1
  Top 1.016: F1.1 14.65,12.21 12.27,12.21 11.83,11.76 11.83,11.4 10.37,9.95
ACCEL_INT
  Top 0.254: U4.13 47.06,24.06 47.57,24.57 47.57,27.89 45.35,30.11 40.99,30.11 39.54,31.56 J5.A5
ACCEL_SCL  (via drill 0.35)
  Top 0.254: U4.59 40.85,13.01 40.92,12.94 v40.92,12.91 | v49.91,27.27 49.91,34.28 41.44,42.75 J5.A4
  Bottom 0.254: v40.92,12.91 41.02,13.02 51.02,13.02 51.84,13.84 51.84,14.17 51.84,14.18 51.84,26.11 51.04,26.91 50.37,26.91 50.03,27.24 49.93,27.24 v49.91,27.27
ACCEL_SDA  (via drill 0.35)
  Top 0.254: U4.60 41.35,13.7 v41.45,13.6 | v50.8,26.33 50.8,26.4 50.75,26.45 50.75,33.84 50.75,34.08 J5.A3
  Bottom 0.254: v50.8,26.33 50.8,25.58 51.43,24.94 51.43,14.01 51.03,13.6 v41.45,13.6
ADJ
  Top 0.254: C3.1 9.5,25.41 9.5,25.11 10.21,24.39 10.21,22.97 7.16,19.92 6.25,19.92 6.04,19.72 6.04,19.01 6.25,18.81 6.96,18.81 U1.2
DRIVE1_A1  (via drill 0.25)
  Top 0.254: v21.18,21.75 21.38,21.96 21.38,22.67 U3.5 | 24.23,66.25 J1.1
  Top 0.508: 24.23,66.25 v23.11,65.14
  Bottom 0.508: v21.18,21.75 15.59,21.75 12.51,25.09 12.51,54.04 v23.11,65.14
DRIVE1_A2  (via drill 0.35)
  Top 0.254: U3.7 22.68,20.49 22.68,20.48 22.76,20.4 v22.8,19.4 | 20.88,66.36 21.18,66.36 J1.2
  Top 0.508: v16.01,63.66 17.16,64.82 17.16,68.01 17.4,68.25 19.08,68.25 20.98,66.34 J1.2
  Bottom 0.508: v16.01,63.66 10.46,58.1 10.46,24.21 14.61,19.6 v22.8,19.4
DRIVE1_B1  (via drill 0.35)
  Top 0.254: U3.10 24.63,22.77 24.62,22.71
  Top 0.381: v24.8,20.4 24.62,20.58 24.62,22.71
  Top 0.508: J1.3 18.24,63.84 v16.8,62.4
  Bottom 0.508: v16.8,62.4 15.51,61.11 14.51,61.11 11.18,57.78 11.18,24.8 11.17,24.59 11.19,24.57 11.19,24.54 11.56,24.17 14.14,21.38 14.14,21.13 14.85,20.41 24.79,20.41 v24.8,20.4
DRIVE1_B2  (via drill 0.35)
  Top 0.381: v23.44,21.4 23.44,22.59 U3.8
  Top 0.508: J1.4 15.24,60.84 v14.8,60.4
  Bottom 0.508: v14.8,60.4 14.8,57.41 11.85,54.45 11.85,54.31 11.84,54.3 11.85,54.04 11.85,25.1 11.84,24.84 11.85,24.83 11.85,24.81 12.03,24.63 14.8,21.64 14.8,21.4 15.11,21.09 15.58,21.09 15.84,21.08 15.85,21.09 21.45,21.09 21.51,21.15 23.33,21.15 23.33,21.29 v23.44,21.4
DRIVE1_CP1
  Top 0.254: U3.1 18.57,22.49 C7.1
DRIVE1_CP2
  Top 0.254: C7.2 19.43,20.85 U3.2
DRIVE1_DECAY
  Top 0.152: U3.19 24.88,28.64 24.88,28.29 25.03,28.13 27.57,28.13 32.15,23.56 U4.37
DRIVE1_DIR
  Top 0.152: U3.20 24.23,28.64 24.23,28.29 24.67,27.85 24.89,27.85 24.91,27.83 26.26,27.83 27.45,27.83 32.21,23.06 U4.38
DRIVE1_ISENA
  Top 0.254: U3.6 22.09,22.67 22.09,18.5 23.41,17.18 23.41,15.66 24.13,14.95 R4.2
DRIVE1_ISENB
  Top 0.254: U3.9 24.02,22.67 24.02,17.59 24.13,17.49 R3.2
DRIVE1_M0
  Top 0.152: U3.24 21.63,29.13 21.63,29.48 24.34,32.19 29.35,32.19 30.22,31.32 30.22,30.62 28.31,28.72 28.31,28.25 32.01,24.56 U4.35
DRIVE1_M1
  Top 0.152: U3.25 20.98,29.13 20.98,29.48 23.99,32.49 29.48,32.49 30.52,31.44 30.52,30.5 28.62,28.59 28.62,28.38 31.94,25.06 U4.34
DRIVE1_M2
  Top 0.152: U3.26 20.33,29.13 20.33,29.48 20.46,29.61 20.68,29.61 23.87,32.8 29.6,32.8 30.83,31.57 30.83,30.37 28.99,28.53 28.99,28.44 31.87,25.56 U4.33
DRIVE1_STEP  (via drill 0.35)
  Top 0.152: U3.22 22.93,29.13 22.93,29.48 25.33,31.88 29.22,31.88 29.91,31.19 29.91,30.75 28.01,28.85 v27.86,29.02 | v28.29,24.7 28.29,16.57 v30.32,14.54 | v35.91,14.54 36.35,14.97 U4.50
  Bottom 0.152: v27.86,29.02 27.86,25.13 v28.29,24.7 | v30.32,14.54 v35.91,14.54
DRIVE1_VCP  (via drill 0.25)
  Top 0.254: v17.62,24.39 18.84,24.39 20.06,23.18 20.06,22.77 U3.3 | v14.58,26.07 14.58,27.44 C9.2
  Bottom 0.254: v14.58,26.07 v17.62,24.39
DRIVE1_VREF  (via drill 0.25)
  Top 0.254: U3.13 26.57,22.77 25.96,22.77 U3.12 25.96,22.87 v25.96,23.68 | v15.19,28.66 15.19,28.97 15.29,29.07 15.29,34.66 15.08,34.86 8.58,34.86 7.36,33.64 R1.2
  Bottom 0.254: v25.96,23.68 20.16,23.68 v15.19,28.66
DRIVE2_A1  (via drill 0.35)
  Top 0.381: 24.04,51.54 24.08,51.57 24.13,51.57 v24.15,51.6 24.06,51.51 24.06,49.52 24.04,49.5 U2.5
  Top 0.508: v46.68,63.97 47.37,64.65 J2.1
  Bottom 0.508: v24.15,51.6 27.15,54.6 35.85,54.6 44.36,63.11 44.43,63.11 44.96,63.64 46.28,63.64 46.68,64.05 v46.68,63.97
DRIVE2_A2  (via drill 0.35)
  Top 0.381: v22.91,50 22.91,49.84 22.87,49.8 22.87,49.08 22.77,48.98 22.77,48.33 U2.7
  Top 0.508: J2.2 44.37,64.22 44.09,63.94 v44.09,63.92
  Bottom 0.508: v44.09,63.92 35.53,55.36 26.74,55.36 22.88,51.5 v22.91,50
DRIVE2_B1  (via drill 0.35)
  Top 0.381: U2.10 20.79,49.46 20.82,49.49 v20.8,49.49
  Top 0.508: v41.35,63.87 41.37,63.88 J2.3
  Bottom 0.508: v41.35,63.87 41.25,63.87 41.25,63.71 34.41,56.88 26.11,56.88 20.8,51.58 v20.8,49.49
DRIVE2_B2  (via drill 0.35)
  Top 0.381: v22.07,49.62 22.09,49.59 U2.8
  Top 0.508: J2.4 38.37,64.54 v38.73,64.17
  Bottom 0.508: v38.73,64.17 38.81,64.09 40.4,64.09 40.98,64.68 41.68,64.68 42.16,64.2 42.16,63.53 34.75,56.12 26.42,56.12 22.07,51.77 v22.07,49.62
DRIVE2_CP1
  Top 0.152: C16.1 26.64,50.13 U2.1
DRIVE2_CP2
  Top 0.152: C16.2 25.99,49.06 U2.2
DRIVE2_DECAY
  Top 0.254: U2.19 20.79,39.31 20.82,39.28 27.55,39.28 30.32,36.51 35.28,36.51 35.99,35.8 35.99,30.38 37.02,29.35 | 37.02,29.35 | 37.02,29.35 37.26,29.11 37.26,28.38 37.35,28.29 U4.29
DRIVE2_DIR
  Top 0.254: U2.20 21.44,39.7 21.46,39.69 27.72,39.69 30.49,36.91 35.45,36.91 36.4,35.97 36.4,30.55 37.19,29.75 | 37.19,29.75 | 37.19,29.75 37.85,29.09 U4.28
DRIVE2_ISENA
  Top 0.152: U2.6 23.39,49.59 23.54,49.74 23.54,50.26 22.78,51.02 22.78,55.89 R10.2
DRIVE2_ISENB
  Top 0.152: R9.2 20.7,54.6 21.43,53.86 U2.9
DRIVE2_M0
  Top 0.254: U2.24 24.04,40.96 24.1,40.91 28.22,40.91 30.99,38.13 35.96,38.13 37.62,36.47 37.62,31.09 39.02,29.68 | 39.02,29.68 | 39.02,29.68 39.35,29.35 U4.25
DRIVE2_M1
  Top 0.254: U2.25 24.69,41.33 24.71,41.31 28.39,41.31 31.16,38.54 36.12,38.54 38.02,36.64 38.02,31.26 39.19,30.09 | 39.19,30.09 | U4.24 39.85,29.43 39.19,30.09
DRIVE2_M2
  Top 0.254: U2.26 25.54,42.32 25.54,42.74 26.11,43.31 27.54,43.31 31.5,39.35 36.46,39.35 38.83,36.98 38.83,31.6 39.53,30.9 | 39.53,30.9 | U4.22 40.85,29.58 39.53,30.9
DRIVE2_STEP
  Top 0.254: U2.22 22.74,40.51 22.73,40.5 28.05,40.5 30.83,37.73 35.79,37.73 37.21,36.3 37.21,30.92 38.85,29.28 U4.26
DRIVE2_VCP  (via drill 0.35)
  Top 0.254: U2.3 25.34,47.31 25.4,47.25 25.4,47.22 v25.31,47.13 | v14.81,46.09 14.81,36.48 C18.2
  Bottom 0.254: v25.31,47.13 19.35,47.13 18.99,46.77 15.34,46.77 14.81,46.24 v14.81,46.09
DRIVE2_VREF  (via drill 0.35)
  Top 0.254: U2.12 U2.13 18.84,49.11 v18.84,49.34 | v13.84,46.85 11.54,46.85 R8.2
  Bottom 0.254: v18.84,49.34 18.84,47.2 | 18.84,47.2 18.82,47.18 | 18.84,47.2 14.12,47.2 13.76,46.85 v13.84,46.85
EXTAL
  Top 0.254: C25.1 53.59,19.49 Y1.1 50.44,22.64 R13.1 49.66,23.06 U4.11
GND  (via drill 0.35)
  Top 0.254: C15.2 14.47,29.78 14.47,31.81 C14.2 14.47,31.91 14.47,33.95 C13.2 14.46,33.97 13.38,33.97 13.36,34 v13.22,34 | U3.EXP 23.01,25.82 23.01,25.92 | 22.91,26.02 U3.EXP | U4.40 34.08,22.06 | 22.81,25.61 U3.EXP | C21.2 46.16,22.06 U4.9 | C23.2 47.78,22.56 U4.10 | U2.28 27.22,42.12 27.25,42.15 27.33,42.07 v27.33,42.05 | C17.2 20.27,37.34 v20.27,35.82 | U3.28 18.78,30.4 | 18.78,30.4 18.84,30.47 | 18.78,30.4 18.77,30.39 v18.77,30.31 | U2.14 18.19,49.43 18.18,49.44 18.11,49.44 v18.03,49.36 | C26.2 39.49,7.83 39.44,7.78 39.34,7.78 v39.32,7.81
  other vias: 18.64,70.42 10.02,67.42 44.04,70.42 53.8,65.4 53.8,53.4 6.8,35.4 2.33,37.35 3.91,54.09 4.49,66.91 30.91,67.75 54.76,9.82 35.99,12.23 29.71,12.63 14.5,7.02 2.79,6.69 44.14,34 36.42,25.21 39.47,25.21 42.52,25.21 42.52,21.65 36.42,21.65 36.42,18.6 39.47,18.6 42.52,18.6 39.47,21.65
  pour Top: -0.2,76.4 -0.2,-0.6 58.8,-0.6 58.8,76.4
  pour Bottom: -0.2,76.4 -0.2,-0.6 58.8,-0.6 58.8,76.4
HALL_IN  (via drill 0.25)
  Top 0.152: U4.49 35.85,16 v35.1,15.25
  Top 0.254: 10,53.55 12.54,56.09 16.61,56.09 R7.1 | 10,53.55 J4.2 | v9.8,53.25 10,53.45 10,53.55
  Bottom 0.254: v35.1,15.25 18.13,15.25 9.8,23.58 v9.8,53.25
OUT_LED
  Top 0.254: D1.A 26.57,1.33 24.13,1.33 24.02,1.43 R2.1
REF
  Top 0.254: C2.1 12.04,23.68 11.53,23.68 7.26,19.42 7.06,19.42 U1.1
RESET_LED
  Top 0.254: D2.A 29.61,3.36 30.32,3.36 32.15,1.53 R16.1
SWDCLK  (via drill 0.35)
  Top 0.254: 49.22,12.2 49.22,9.97 47.7,8.44 J6.4 | 49.22,12.2 R15.2 | U4.62 42.35,13.53 42.11,13.3 42.11,11.53 42.45,11.19 42.94,11.19 43.26,11.52 v44.04,11.52 | v44.98,10.5 47.52,10.5 49.22,12.2
  Bottom 0.254: v44.04,11.52 45,10.55 45.03,10.55 v44.98,10.5
SWDIO  (via drill 0.35)
  Top 0.254: J6.2 46.61,8.57 46.61,9.71 v46.58,9.69 | v45.82,11.34 46.42,11.34 R14.2 | U4.64 43.35,13.18 44.22,12.3 v44.32,12.3
  Bottom 0.254: v46.58,9.69 46.58,10.6 45.82,11.36 | 45.82,11.36 v45.82,11.34 | v44.32,12.3 44.88,12.3 45.82,11.36
SWO  (via drill 0.35)
  Top 0.254: J6.6 49.69,9.12 49.69,9.13 50.21,9.65 50.21,15.89 v50.26,15.89 | v46.68,25.66 46.58,25.56 U4.16
  Bottom 0.254: v50.26,15.89 50.26,24.96 48.39,26.83 47.91,26.83 46.85,25.77 46.61,25.77 46.68,25.69 v46.68,25.66
TDI  (via drill 0.35)
  Top 0.254: J6.8 50.23,9.09 50.62,9.48 50.62,14.9 50.85,15.12 v50.85,15.02 | v46.75,26.49 46.75,28.07 46.78,28.1 45.18,29.7 43.96,29.7 43.35,29.09 U4.17
  Bottom 0.254: v50.85,15.02 v50.84,15.02 50.84,24.95 48.56,27.24 47.74,27.24 47.01,26.5 46.68,26.5 46.7,26.49 v46.75,26.49
XTAL
  Top 0.254: C24.1 55.93,29.03 Y1.2 53.55,27.84 R13.2 49.27,23.56 U4.12

### Text on the board
tPlace: AUTOMO-BIKE